# EAGLE design Board1 (EAGLE 9.5.1)
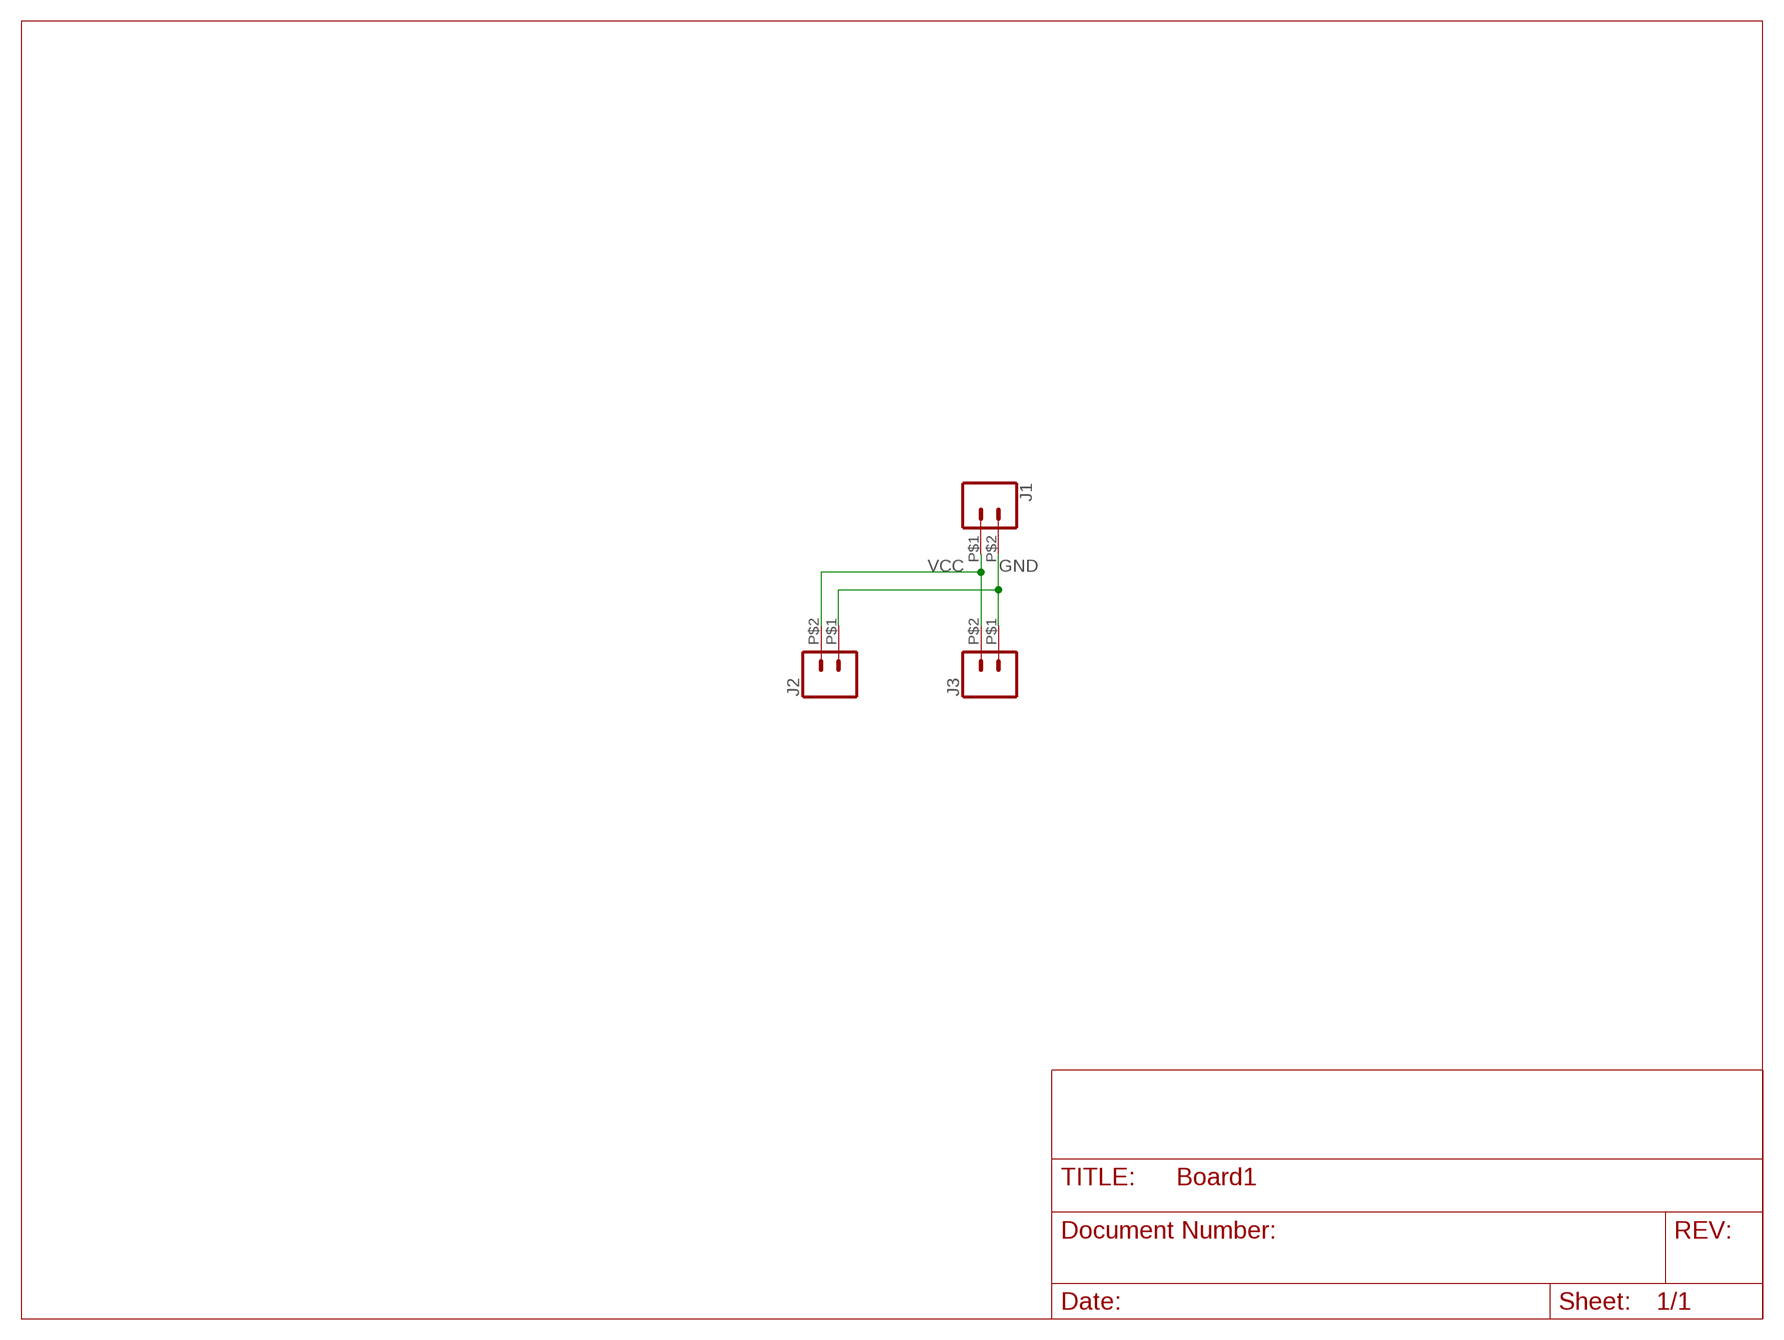
[diagram p0: schematic, sheet 1]

## Parts
J1  CONN_02PTH2  [1X02_BIG]
J2  CONN_02PTH2  [1X02_BIG]
J3  CONN_02PTH2  [1X02_BIG]

## Nets
GND: J1.P$2 J2.P$1 J3.P$1
VCC: J1.P$1 J2.P$2 J3.P$2

## Library data of the parts
J1-J3 = SparkFun-Connectors:CONN_02: Multi connection point. Often used as Generic Header-pin footprint for 0.1 inch spaced/style header connections On any of the 0.1 inch spaced packages, you can populate with these: Break Away Headers - Straight <https://www.sparkfun.com/products/116> (PRT-00116) Break Away Male Headers - Right Angle <https://www.sparkfun.com/products/553> (PRT-00553) Female Headers <https://www.sparkfun.com/products/115> (PRT-00115) Break Away Headers - Machine Pin <https://www.sparkfun.com/products/117> (PRT-00117) Break Away Female Headers - Swiss Machine Pin <https://www.sparkfun.com/products/743> (PRT-00743) For SCREWTERMINALS and SPRING TERMINALS visit here: Screw Terimnals on SparkFun.com <https://www.sparkfun.com/search/results?term=Screw+Terminals> (5mm/3.5mm/2.54mm spacing) This device is also useful as a general connection point to wire up your design to another part of your project. Our various solder wires solder well into these plated through hole pads. Hook-Up Wire - Assortment (Stranded, 22 AWG) <https://www.sparkfun.com/products/11375> (PRT-11375) Hook-Up Wire - Assortment (Solid Core, 22 AWG) <https://www.sparkfun.com/products/11367> (PRT-11367) View the entire wire category on our website here <https://www.sparkfun.com/categories/141> Special notes: Molex polarized connector foot print use with: PRT-08233 with associated crimp pins and housings. 2.54_SCREWTERM for use with PRT-10571. 3.5mm Screw Terminal footprints for PRT-08084 5mm Screw Terminal footprints for use with PRT-08432

## Board
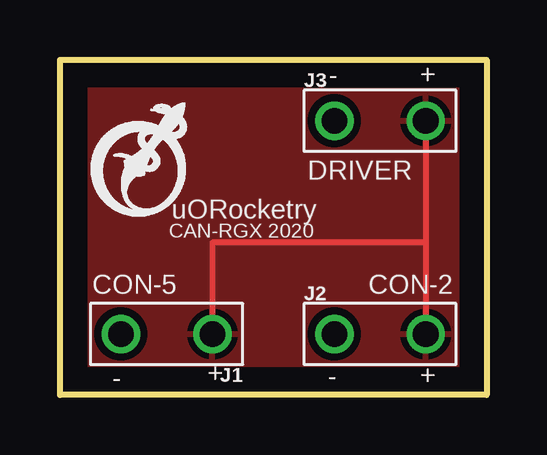
[diagram p1: board, top side]
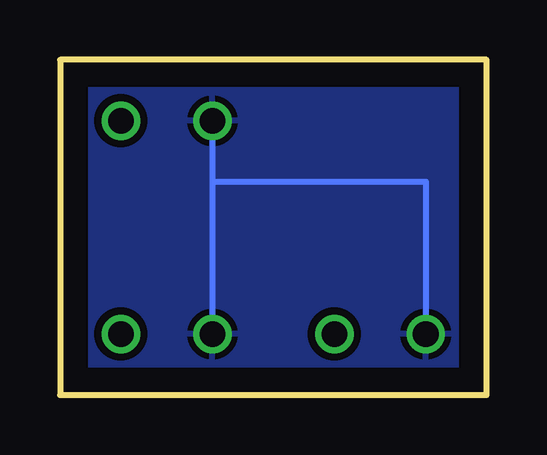
[diagram p2: board, bottom side, seen from below]

Size 17.78 x 13.97 mm. Coordinates in mm from the lower left corner, seen from the top.
Outline: 0,0 0,13.97 17.78,13.97 17.78,0 0,0
Copper layers (1*16): Top 0.035mm / dielectric 1.5mm / Bottom 0.035mm
Design rules "default": minimum track width 6mil, minimum drill 0.35mm, track to track 6mil, track to pad 6mil, pad to pad 6mil, via to via 6mil, smd to smd 6mil, copper to edge 40mil, drill to drill 6mil, minimum pad ring 10mil, minimum via ring 8mil, stop-mask expansion 4mil, vias tented up to drill 0mil, thermal gap 10mil

### Footprints (pad centres in the part's own frame; a part is rotated, then mirrored left to right if it is on the bottom)
1X02_BIG = drill 1.067: P$1 0,0; P$2 3.81,0

### Placement (x,y rotation side)
J1  6.35,2.54 180 top
J2  11.43,2.54 0 top
J3  11.43,11.43 0 top

### Tracks (layer width: path | path; a pad name or v marks a point on that pad's centre or on a via)
GND
  Bottom 0.254: J3.P$1 11.43,8.89 | 11.43,8.89 J2.P$1 | 11.43,8.89 2.54,8.89 J1.P$2
  pour Bottom (isolate 0.305): 0,13.97 17.78,13.97 17.78,0 0,0
VCC
  Top 0.254: J3.P$2 15.24,6.35 | 15.24,6.35 J2.P$2 | 15.24,6.35 6.35,6.35 J1.P$1
  pour Top (isolate 0.305): 0,13.97 17.78,13.97 17.78,0 0,0

### Text on the board
tSilk: - | + | DRIVER | CAN-RGX 2020 | uORocketry | CON-5 | CON-2 | + | - | - | +